# Altium schematic sheet battery.SchDoc
size A4
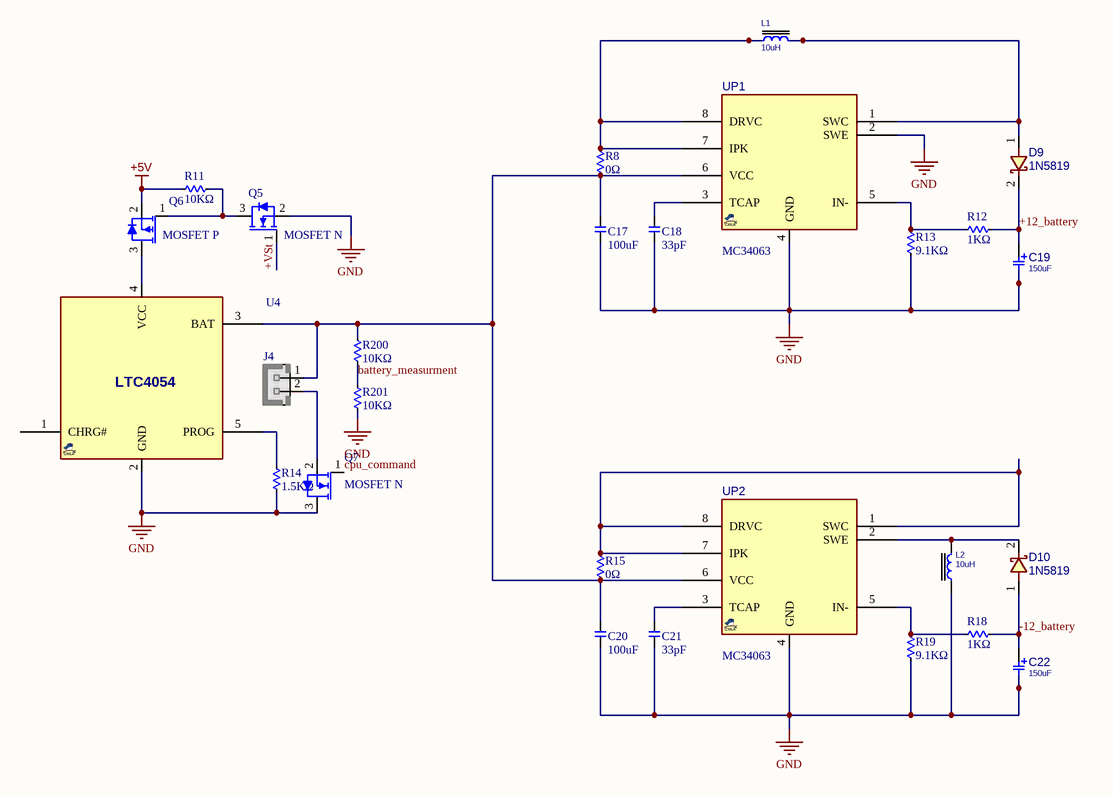
[diagram p0: battery.SchDoc]

## Parts
C17  100uF  [CAP 1206 100u]
C18  33pF  [CAP 0603 33p]
C19  150uF  [C_EL_8X12]
C20  100uF  [CAP 1206 100u]
C21  33pF  [CAP 0603 33p]
C22  150uF  [C_EL_8X12]
D9  1N5819  [D_SOD123W]
D10  1N5819  [D_SOD123W]
J4  HHDR_2  [XH_2]  (value not drawn)
L1  10uH  [L_7]
L2  10uH  [L_7]
Q5  MOSFET N  [SOT23]
Q6  MOSFET P  [SOT23]
Q7  MOSFET N  [SOT23]
R8  0Ω  [RES 0603 0]
R11  10KΩ  [RES 0603 10K]
R12  1KΩ  [RES 0603 1K]
R13  9.1KΩ  [RES 0603]
R14  1.5KΩ  [RES 0603 1.5K]
R15  0Ω  [RES 0603 0]
R18  1KΩ  [RES 0603 1K]
R19  9.1KΩ  [RES 0603]
R200  10KΩ  [RES 0603 10K]
R201  10KΩ  [RES 0603 10K]
U4  LTC4054  [SOT23_5]  (value not drawn)
UP1  MC34063  [SO_8]
UP2  MC34063  [SO_8]

## Nets
+5V: Q6.2(S) R11.1
GND: C17.2 C18.2 C19.2 C20.2 C21.2 C22.2 L2.1 Q5.2(S) Q7.3(D) R13.2 R14.1 R19.2 R201.2 U4.2(GND) UP1.2(SWE) UP1.4(GND) UP2.4(GND)
+12_battery: C19.1 D9.2 R12.2
+VSt: Q5.1(G)
-12_battery: C22.1 D10.1 R18.2
battery_measurment: R200.2 R201.1
cpu_command: Q7.1(G)
NetC17_1: C17.1 C20.1 J4.1 R8.2 R15.2 R200.1 U4.3(BAT) UP1.6(VCC) UP2.6(VCC)
NetC18_1: C18.1 UP1.3(TCAP)
NetC21_1: C21.1 UP2.3(TCAP)
NetD9_1: D9.1 L1.2 UP1.1(SWC)
NetD10_2: D10.2 L2.2 UP2.2(SWE)
NetJ4_2: J4.2 Q7.2(S)
NetL1_1: L1.1 R8.1 UP1.7(IPK) UP1.8(DRVC)
NetQ5_3: Q5.3(D) Q6.1(G) R11.2
NetQ6_3: Q6.3(D) U4.4(VCC)
NetR12_1: R12.1 R13.1 UP1.5(IN-)
NetR14_2: R14.2 U4.5(PROG)
NetR15_1: R15.1 UP2.1(SWC) UP2.7(IPK) UP2.8(DRVC)
NetR18_1: R18.1 R19.1 UP2.5(IN-)

Not connected (* = marked no-connect by the designer): U4 1(CHRG#)

## Library data of the parts
C17 C20 = CAP 100uF
C18 C21 = CAP 33pF
C19 C22 = CAP_THD_EL: CAP, THD, ELEC,; MANF_P#: MANF_PART#; PARAM2: 20%; DESC: DESCRIPTION; DIST#: MOUSER; PARAM: 25V; PRICE: 10= 5$; MANF: MANF; ASSEMBLY: ASSEMBLY; VALUE: 150uF
D9 D10 = DIODE_SMD_SCHOTTKY_1N5819: DIODE, SCHOTTKY, 40V, 1A; MANF: DIODES; MANF_P#: 1N5819HW-7-F; DESC: DESCRIPTION; ASSEMBLY: ASSEMBLY; PRICE: PRICE; PARAM2: 1A; PARAM: 40V; VALUE: 1N5819
J4 = XH_2: JST-XH pitch: 2.5mm; VALUE: HHDR_2
L1 L2 = IND_SMD_10uH_2A: INDUCTOR, 10uH 2A, 38mOhm, 2626; PARAM: 2A Irms, 2.05A Isat; MANF_P#: SRR6038-100Y; MANF: Bourns; PRICE: 2.5$; DESC: INDUCTOR, 10uH 2A, 38mOhm, 2626; PARAM2: 38mOhm; ASSEMBLY: ASSEMBLY; VALUE: 10uH
R8 R15 = RES 0
R11 R200 R201 = RES 10K
R12 R18 = RES 1K
R13 R19 = RES
R14 = RES 1.5K
U4 = LTC4054_SOT23-5: PWR, CHARGER, Linear, Li-Ion, 0.8A, 4.2v; MANF: ANALOG DEVICE/LINEAR; MANF_P#: LTC4054ES5-4.2; PARAM2: 4.2~6.5Vcc, -40~85oC; PARAM: Li-Ion, 0.8A, 4.2v; PRICE: 5t@JAVAN; VALUE: LTC4054
UP1 UP2 = VREG_MC34063: REG, Switching, Buck/Boost/Inv, 1.5A, ADJ, 100KHz,3~40VIN, SO-8; MANF: TI, ON, HTC; MANF_P#: MC34063AD, HTC34063; ASSEMBLY: ASSEMBLY; PARAM: 1.5A, ADJ; PRICE: 600t@PAYA; DESC: REG, Switching, Buck/Boost/Inv, 1.5A, ADJ, 100KHz,3~40VIN, SO-8; PARAM2: 100KHz,3~40VIN; VALUE: MC34063